# Altium schematic sheet S08_DisplayPort.SchDoc: DisplayPort
size 381 x 241 mm; SheetNumber: 8; SheetTotal: 12
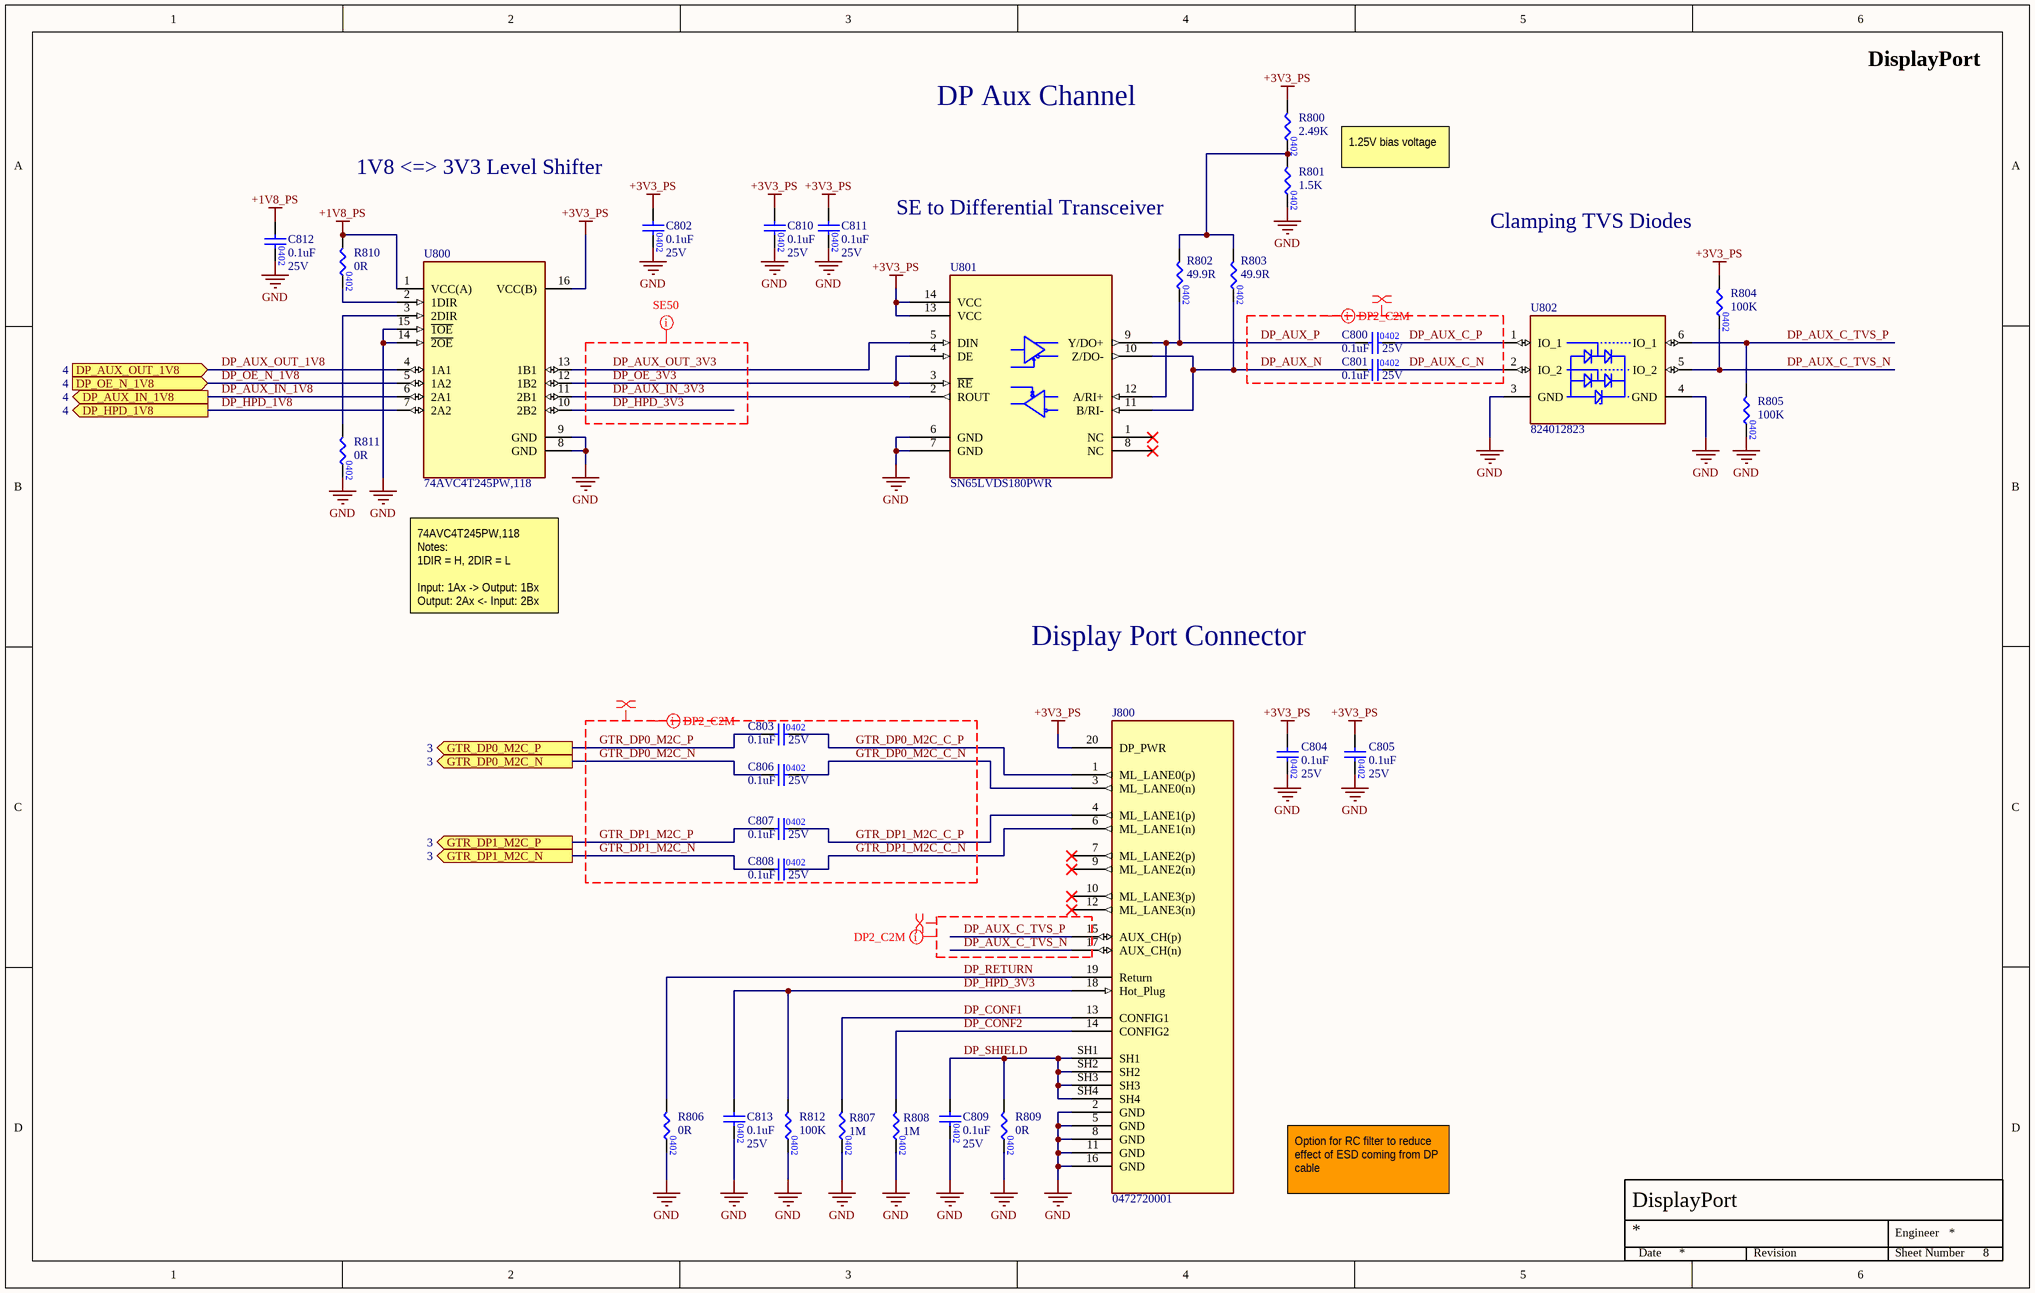
[diagram p0: S08_DisplayPort.SchDoc]

## Parts
C800  value 0.1uF  Voltage Rating: 25V  [CAP0402]  (hidden comment: CAP_0402)
C801  value 0.1uF  Voltage Rating: 25V  [CAP0402]  (hidden comment: CAP_0402)
C802  value 0.1uF  Voltage Rating: 25V  [CAP0402]  (hidden comment: CAP_0402)
C803  value 0.1uF  Voltage Rating: 25V  [CAP0402]  (hidden comment: CAP_0402)
C804  value 0.1uF  Voltage Rating: 25V  [CAP0402]  (hidden comment: CAP_0402)
C805  value 0.1uF  Voltage Rating: 25V  [CAP0402]  (hidden comment: CAP_0402)
C806  value 0.1uF  Voltage Rating: 25V  [CAP0402]  (hidden comment: CAP_0402)
C807  value 0.1uF  Voltage Rating: 25V  [CAP0402]  (hidden comment: CAP_0402)
C808  value 0.1uF  Voltage Rating: 25V  [CAP0402]  (hidden comment: CAP_0402)
C809  value 0.1uF  Voltage Rating: 25V  [CAP0402]  (hidden comment: CAP_0402)
C810  value 0.1uF  Voltage Rating: 25V  [CAP0402]  (hidden comment: CAP_0402)
C811  value 0.1uF  Voltage Rating: 25V  [CAP0402]  (hidden comment: CAP_0402)
C812  value 0.1uF  Voltage Rating: 25V  [CAP0402]  (hidden comment: CAP_0402)
C813  value 0.1uF  Voltage Rating: 25V  [CAP0402]  (hidden comment: CAP_0402)
J800  0472720001  [0472720001]
R800  Resistance: 2.49K  [RES0402]  (hidden comment: RES_0402)
R801  Resistance: 1.5K  [RES0402]  (hidden comment: RES_0402)
R802  Resistance: 49.9R  [RES0402]  (hidden comment: RES_0402)
R803  Resistance: 49.9R  [RES0402]  (hidden comment: RES_0402)
R804  Resistance: 100K  [RES0402]  (hidden comment: RES_0402)
R805  Resistance: 100K  [RES0402]  (hidden comment: RES_0402)
R806  Resistance: 0R  [RES0402]  (hidden comment: RES_0402)
R807  Resistance: 1M  [RES0402]  (hidden comment: RES_0402)
R808  Resistance: 1M  [RES0402]  (hidden comment: RES_0402)
R809  Resistance: 0R  [RES0402]  (hidden comment: RES_0402)
R810  Resistance: 0R  [RES0402]  (hidden comment: RES_0402)
R811  Resistance: 0R  [RES0402]  (hidden comment: RES_0402)
R812  Resistance: 100K  [RES0402]  (hidden comment: RES_0402)
U800  74AVC4T245PW,118  [SOP65P640X110-16N]
U801  SN65LVDS180PWR  [TI_TSSOP14_PW]
U802  824012823  [824012823]

## Ports
DP_AUX_IN_1V8 (out, see 4), DP_AUX_OUT_1V8 (in, see 4), DP_HPD_1V8 (out, see 4), DP_OE_N_1V8 (in, see 4), GTR_DP0_M2C_N (out, see 3), GTR_DP0_M2C_P (out, see 3), GTR_DP1_M2C_N (out, see 3), GTR_DP1_M2C_P (out, see 3)

## Nets
+1V8_PS: C812.1 R810.1 U800.1(VCC(A))
+3V3_PS: C802.1 C804.1 C805.1 C810.1 C811.1 J800.20(DP_PWR) R800.1 R804.1 U800.16(VCC(B)) U801.13(VCC) U801.14(VCC)
GND: C802.2 C804.2 C805.2 C809.2 C810.2 C811.2 C812.2 C813.2 J800.2(GND) J800.5(GND) J800.8(GND) J800.11(GND) J800.16(GND) R801.2 R805.2 R806.2 R807.2 R808.2 R809.2 R811.2 R812.2 U800.8(GND) U800.9(GND) U800.14(~{2OE}) U800.15(~{1OE}) U801.6(GND) U801.7(GND) U802.3(GND) U802.4(GND)
DP_AUX_C_N: C801.2 U802.2(IO_2)
DP_AUX_C_P: C800.2 U802.1(IO_1)
DP_AUX_C_TVS_N: J800.17(AUX_CH(n)) R804.2 U802.5(IO_2)
DP_AUX_C_TVS_P: J800.15(AUX_CH(p)) R805.1 U802.6(IO_1)
DP_AUX_IN_1V8: U800.6(2A1) ; port DP_AUX_IN_1V8
DP_AUX_IN_3V3: U800.11(2B1) U801.2(ROUT)
DP_AUX_N: C801.1 R803.2 U801.10(Z/DO-) U801.11(B/RI-)
DP_AUX_OUT_1V8: U800.4(1A1) ; port DP_AUX_OUT_1V8
DP_AUX_OUT_3V3: U800.13(1B1) U801.5(DIN)
DP_AUX_P: C800.1 R802.2 U801.9(Y/DO+) U801.12(A/RI+)
DP_CONF1: J800.13(CONFIG1) R807.1
DP_CONF2: J800.14(CONFIG2) R808.1
DP_HPD_1V8: U800.7(2A2) ; port DP_HPD_1V8
DP_HPD_3V3: C813.1 J800.18(Hot_Plug) R812.1 U800.10(2B2)
DP_OE_3V3: U800.12(1B2) U801.3(~{RE}) U801.4(DE)
DP_OE_N_1V8: U800.5(1A2) ; port DP_OE_N_1V8
DP_RETURN: J800.19(Return) R806.1
DP_SHIELD: C809.1 J800.SH1 J800.SH2 J800.SH3 J800.SH4 R809.1
GTR_DP0_M2C_C_N: C806.2 J800.3(ML_LANE0(n))
GTR_DP0_M2C_C_P: C803.2 J800.1(ML_LANE0(p))
GTR_DP0_M2C_N: C806.1 ; port GTR_DP0_M2C_N
GTR_DP0_M2C_P: C803.1 ; port GTR_DP0_M2C_P
GTR_DP1_M2C_C_N: C808.2 J800.6(ML_LANE1(n))
GTR_DP1_M2C_C_P: C807.2 J800.4(ML_LANE1(p))
GTR_DP1_M2C_N: C808.1 ; port GTR_DP1_M2C_N
GTR_DP1_M2C_P: C807.1 ; port GTR_DP1_M2C_P
NetR800_2: R800.2 R801.1 R802.1 R803.1
NetR810_2: R810.2 U800.2(1DIR)
NetR811_1: R811.1 U800.3(2DIR)

Not connected (* = marked no-connect by the designer): J800 7(ML_LANE2(p))* 9(ML_LANE2(n))* 10(ML_LANE3(p))* 12(ML_LANE3(n))*; U801 1(NC)* 8(NC)*

## Layout directives
differential pair; differential pair class DIFFPAIR90: DP_AUX_C_N, DP_AUX_C_P, DP_AUX_C_TVS_N, DP_AUX_C_TVS_P, DP_AUX_N, DP_AUX_P, GTR_DP0_M2C_C_N, GTR_DP0_M2C_C_P, GTR_DP0_M2C_N, GTR_DP0_M2C_P, GTR_DP1_M2C_C_N, GTR_DP1_M2C_C_P, GTR_DP1_M2C_N, GTR_DP1_M2C_P
net class DIFFPAIR_DP: DP_AUX_C_N, DP_AUX_C_P, DP_AUX_C_TVS_N, DP_AUX_C_TVS_P, DP_AUX_N, DP_AUX_P, GTR_DP0_M2C_C_N, GTR_DP0_M2C_C_P, GTR_DP0_M2C_N, GTR_DP0_M2C_P, GTR_DP1_M2C_C_N, GTR_DP1_M2C_C_P, GTR_DP1_M2C_N, GTR_DP1_M2C_P
net class SE50: DP_AUX_IN_3V3, DP_AUX_OUT_3V3, DP_HPD_3V3, DP_OE_3V3

## Notes on the sheet
- DP Aux Channel
- 1.25V bias voltage
- 1V8 <=> 3V3 Level Shifter
- SE to Differential Transceiver
- Clamping TVS Diodes
- 74AVC4T245PW,118 Notes:
  1DIR = H, 2DIR = L
  Input: 1Ax -> Output: 1Bx
  Output: 2Ax <- Input: 2Bx
- Display Port Connector
- Option for RC filter to reduce effect of ESD coming from DP cable
- Engineer
- Date
- Revision
- Sheet Number

## Library data of the parts
C800-C813 = CAP_CL05A104KA5NNNC: CAP CER 0.1UF 25V X5R 0402; Manufacturer: Samsung Electro-Mechanics; Tolerance: 10%; Manufacturer Part Number 1: CL05A104KA5NNNC; Case/Package: 0402; Mounting Type: Surface Mount; Temperature Coefficient: X5R
J800 = 0472720001: CONN RCPT DISPLAYPORT 20P SMD RA; Manufacturer_Name: Molex; Datasheet Link: http://www.molex.com/pdm_docs/sd/472720001_sd.pdf; Height: 6.9mm; Manufacturer_Part_Number: 0472720001; Mouser Part Number: N/A; Mouser Price/Stock: https://www.mouser.co.uk/ProductDetail/Molex/0472720001?qs=PBcRNPEHKsrarbeLf7n8sg%3D%3D; Arrow Part Number: 0472720001; Arrow Price/Stock: https://www.arrow.com/en/products/0472720001/molex?region=europe
R800 = .RES_RC0402FR-072K49L: RES 2.49K OHM 1% 1/16W 0402; Manufacturer: YAGEO; Manufacturer Part Number: RC0402FR-072K49L; Case/Package: 0402; Tolerance: 1%
R801 = .RES_RC0402FR-071K5L: RES 1.5K OHM 1% 1/16W 0402; Manufacturer: YAGEO; Manufacturer Part Number: RC0402FR-071K5L; Case/Package: 0402; Tolerance: 1%
R802 R803 = .RES_RC0402FR-0749R9L: RES 49.9 OHM 1% 1/16W 0402; Manufacturer: YAGEO; Manufacturer Part Number: RC0402FR-0749R9L; Case/Package: 0402; Tolerance: 1%
R804 R805 R812 = .RES_RC0402FR-07100KL: RES 100K OHM 1% 1/16W 0402; Manufacturer: YAGEO; Manufacturer Part Number: RC0402FR-07100KL; Case/Package: 0402; Tolerance: 1%
R806 R809-R811 = .RES_RC0402JR-070RL: RES 0 OHM JUMPER 1/16W 0402; Manufacturer: YAGEO; Tolerance: 1%; Manufacturer Part Number: RC0402JR-070RL; Case/Package: 0402
R807 R808 = .RES_RC0402FR-071ML: RES 1M OHM 1% 1/16W 0402; Manufacturer: YAGEO; Manufacturer Part Number: RC0402FR-071ML; Case/Package: 0402; Tolerance: 1%
U800 = 74AVC4T245PW,118: IC TRANSLATION TXRX 3.6V 16TSSOP; Manufacturer_Name: Nexperia; Datasheet Link: https://assets.nexperia.com/documents/data-sheet/74AVC4T245.pdf; Height: 1.1mm; Manufacturer_Part_Number: 74AVC4T245PW,118; Mouser Part Number: 771-74AVC4T245PW118; Mouser Price/Stock: https://www.mouser.co.uk/ProductDetail/Nexperia/74AVC4T245PW118?qs=Lc7Es0%252BIaGKdmOKZhQIwZQ%3D%3D; Arrow Part Number: 74AVC4T245PW,118; Arrow Price/Stock: https://www.arrow.com/en/products/74avc4t245pw118/nexperia?region=nac; Supplier 1: Digi-Key; Supplier Part Number 1: 1727-6573-6-ND
U801 = SN65LVDS180PWR: IC TRANSCEIVER FULL 1/1 14TSSOP; Manufacturer_Name: Texas Instruments; Datasheet Link: https://www.ti.com/lit/ds/symlink/sn65lvds050.pdf; Height: 1.2 mm; Manufacturer_Part_Number: SN65LVDS180PWR
U802 = 824012823: TVS DIODE 3.3VWM 13VC DFN1210-6; Manufacturer_Name: Wurth Elektronik; Voltage Breakdown: 4.5V; Datasheet Link: https://www.we-online.com/catalog/datasheet/824012823.pdf; Height: 0.5mm; Manufacturer_Part_Number: 824012823; Mouser Part Number: 710-824012823; Mouser Price/Stock: https://www.mouser.co.uk/ProductDetail/Wurth-Elektronik/824012823?qs=rrS6PyfT74dPtw7q26tZFg%3D%3D; Supplier 1: Digi-Key; Supplier Part Number: 732-11794-6-ND